# Altium schematic sheet 04 MCU.SchDoc: MCU
size 420 x 297 mm; SheetNumber: 3; SheetTotal: 10
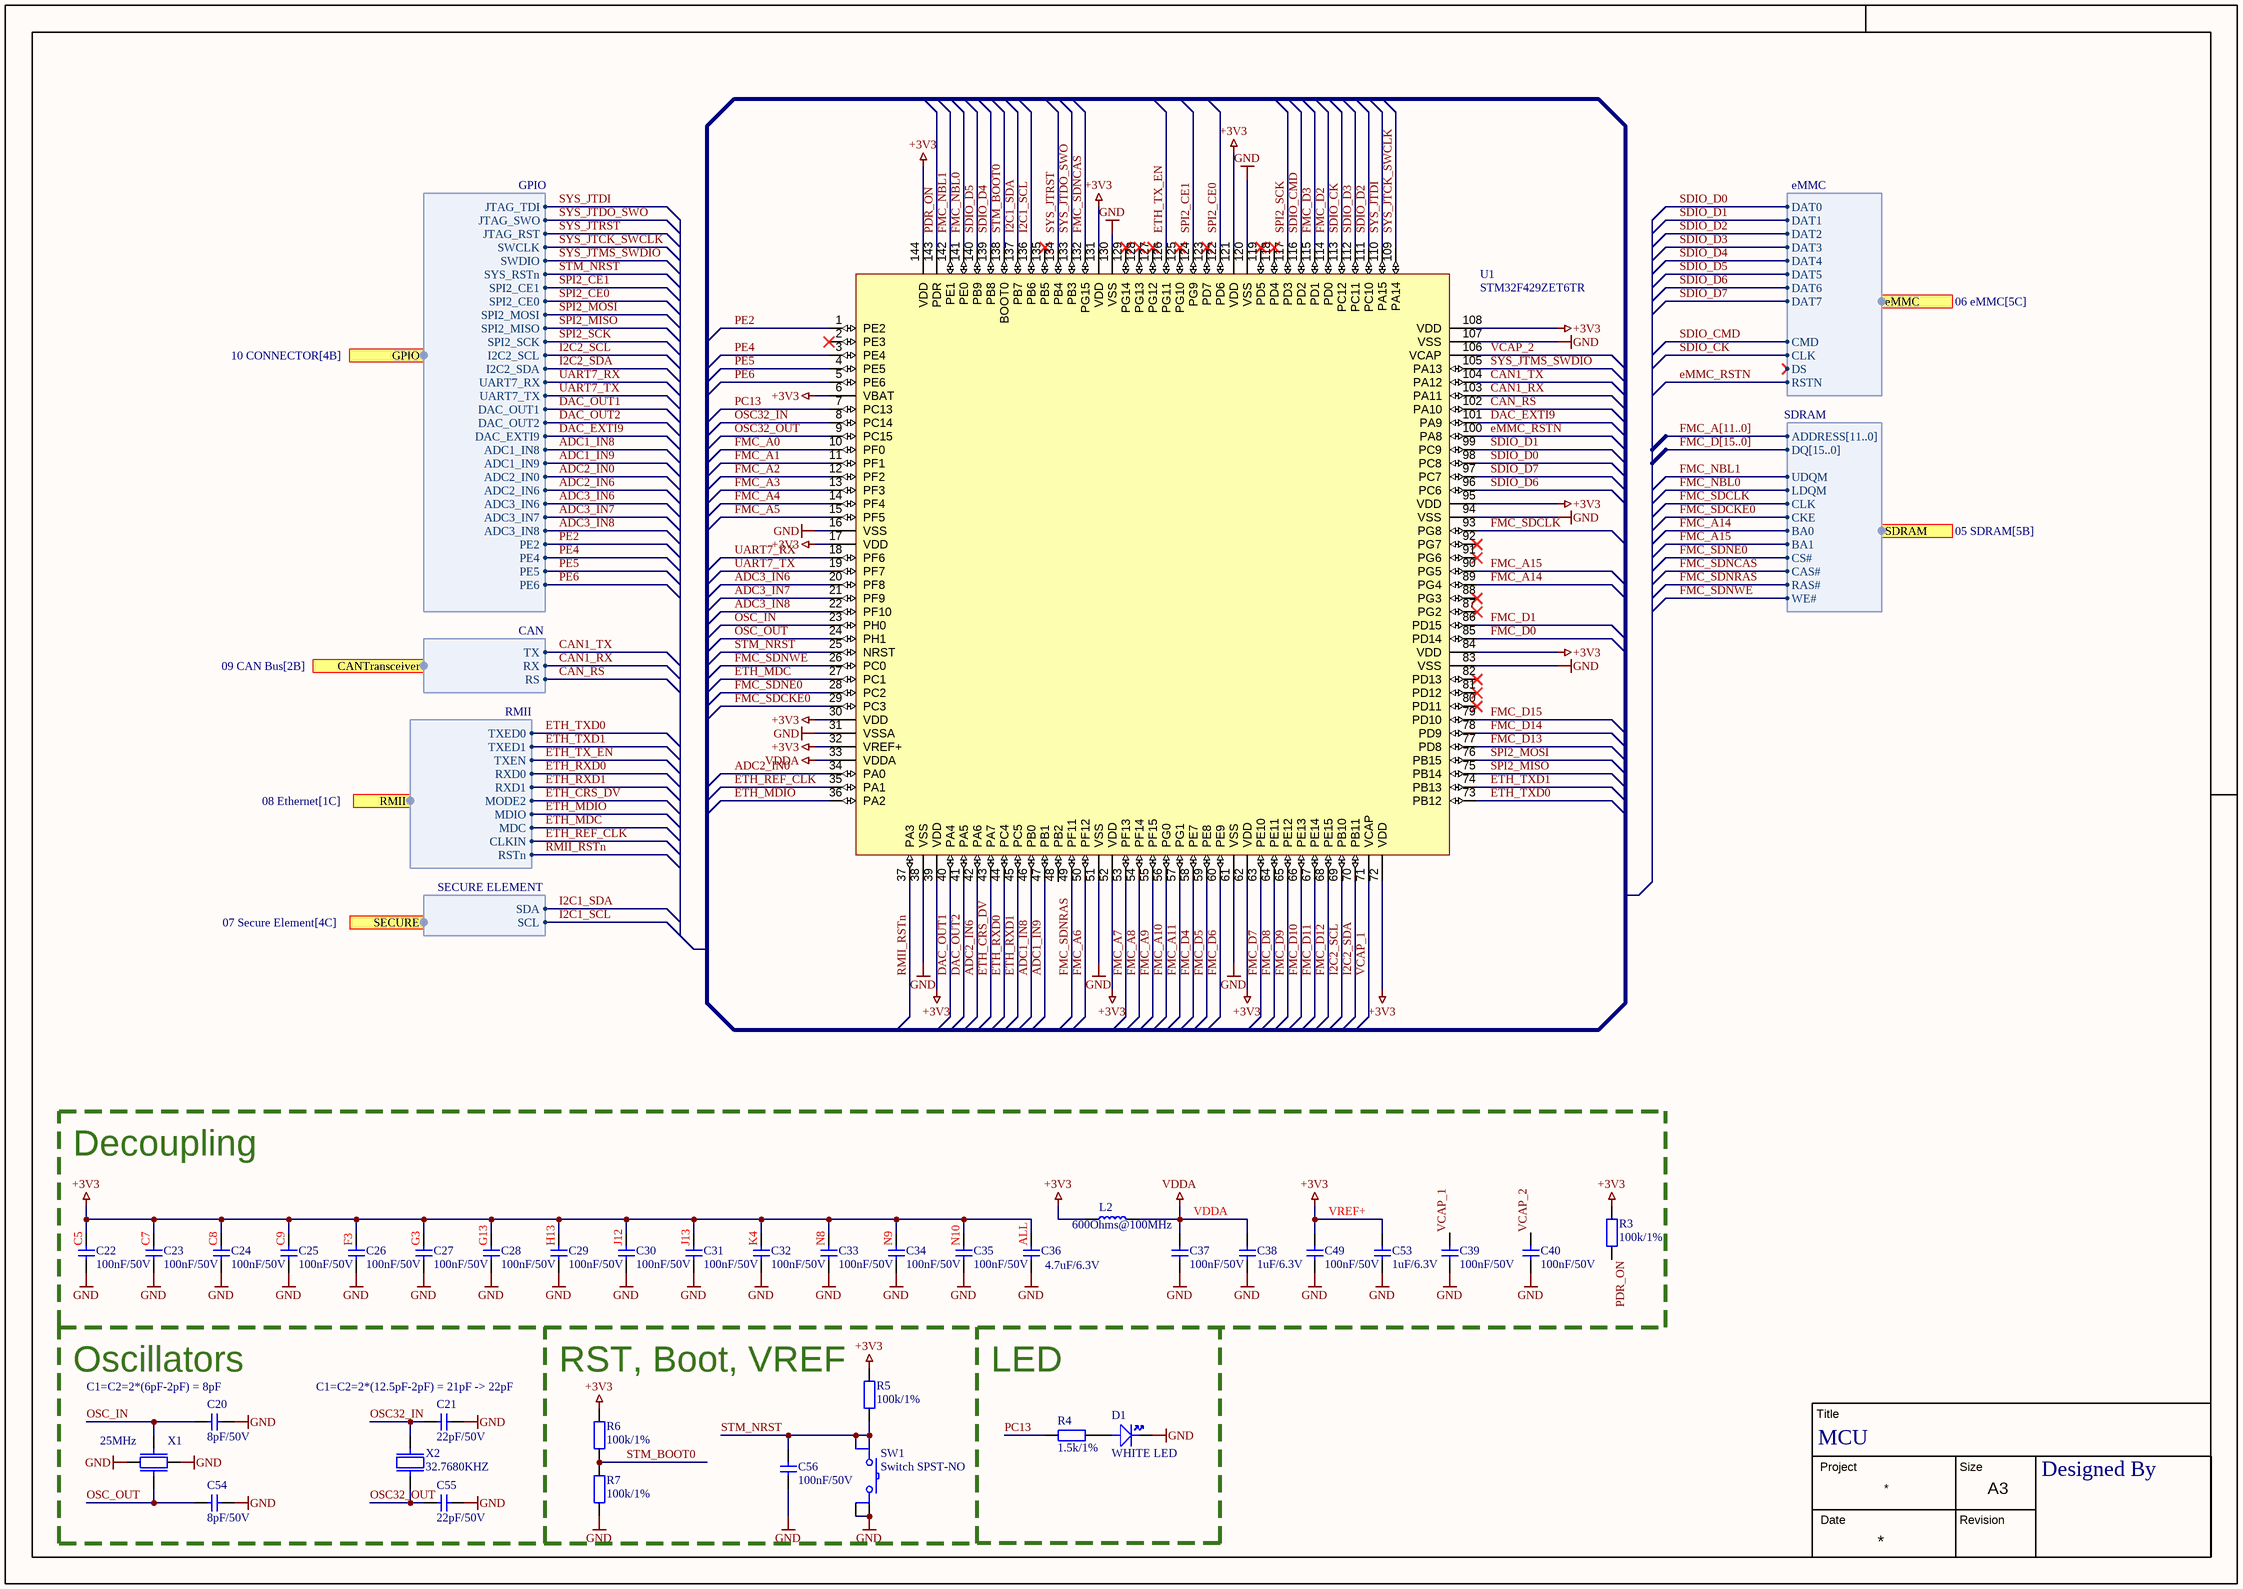
[diagram p0: 04 MCU.SchDoc]

## Parts
C20  8pF/50V  [CAPC1005X06M-0402]
C21  22pF/50V  [CAPC1005X06M-0402]
C22  100nF/50V  [CAPC1005X06M-0402]
C23  100nF/50V  [CAPC1005X06M-0402]
C24  100nF/50V  [CAPC1005X06M-0402]
C25  100nF/50V  [CAPC1005X06M-0402]
C26  100nF/50V  [CAPC1005X06M-0402]
C27  100nF/50V  [CAPC1005X06M-0402]
C28  100nF/50V  [CAPC1005X06M-0402]
C29  100nF/50V  [CAPC1005X06M-0402]
C30  100nF/50V  [CAPC1005X06M-0402]
C31  100nF/50V  [CAPC1005X06M-0402]
C32  100nF/50V  [CAPC1005X06M-0402]
C33  100nF/50V  [CAPC1005X06M-0402]
C34  100nF/50V  [CAPC1005X06M-0402]
C35  100nF/50V  [CAPC1005X06M-0402]
C36  4.7uF/6.3V  [CAPC1005X06M-0402]
C37  100nF/50V  [CAPC1005X06M-0402]
C38  1uF/6.3V  [CAPC1005X06M-0402]
C39  100nF/50V  [CAPC1005X06M-0402]
C40  100nF/50V  [CAPC1005X06M-0402]
C49  100nF/50V  [CAPC1005X06M-0402]
C53  1uF/6.3V  [CAPC1005X06M-0402]
C54  8pF/50V  [CAPC1005X06M-0402]
C55  22pF/50V  [CAPC1005X06M-0402]
C56  100nF/50V  [CAPC1005X06M-0402]
D1  WHITE LED  [LED-0402]
L2  600Ohms@100MHz  [INDC1005X06M-0402]
R3  100k/1%  [RESC1005X04M-0402]
R4  1.5k/1%  [RESC1005X04M-0402]
R5  100k/1%  [RESC1005X04M-0402]
R6  100k/1%  [RESC1005X04M-0402]
R7  100k/1%  [RESC1005X04M-0402]
SW1  Switch SPST-NO  [PTS815 SJM 250 SMTR LFS]
U1  STM32F429ZET6TR  [TSQFP50P2200X2200X160-144N]
X1  25MHz  [4-SMD]
X2  32.7680KHZ  [2-SMD]

## Ports
CANTransceiver (harness CAN, see 09 CAN Bus[2B]), eMMC (harness eMMC, see 06 eMMC[5C]), GPIO (harness GPIO, see 10 CONNECTOR[4B]), RMII (harness RMII, see 08 Ethernet[1C]), SDRAM (harness SDRAM, see 05 SDRAM[5B]), SECURE (harness SECURE ELEMENT, see 07 Secure Element[4C])

## Harnesses
SDRAM: ADDRESS[11..0], DQ[15..0], UDQM, LDQM, CLK, CKE, BA0, BA1, CS#, CAS#, RAS#, WE#
SECURE ELEMENT: SDA, SCL
RMII: TXED0, TXED1, TXEN, RXD0, RXD1, MODE2, MDIO, MDC, CLKIN, RSTn
GPIO: JTAG_TDI, JTAG_SWO, JTAG_RST, SWCLK, SWDIO, SYS_RSTn, SPI2_CE1, SPI2_CE0, SPI2_MOSI, SPI2_MISO, SPI2_SCK, I2C2_SCL, I2C2_SDA, UART7_RX, UART7_TX, DAC_OUT1, DAC_OUT2, DAC_EXTI9, ADC1_IN8, ADC1_IN9, ADC2_IN0, ADC2_IN6, ADC3_IN6, ADC3_IN7, ADC3_IN8, PE2, PE4, PE5, PE6
CAN: TX, RX, RS
eMMC: DAT0, DAT1, DAT2, DAT3, DAT4, DAT5, DAT6, DAT7, CMD, CLK, DS, RSTN

## Nets
+3V3: C22.2 C23.2 C24.2 C25.2 C26.2 C27.2 C28.2 C29.2 C30.2 C31.2 C32.2 C33.2 C34.2 C35.2 C36.2 C49.2 C53.2 L2.1 R3.1 R5.1 R6.1 U1.6(VBAT) U1.17(VDD) U1.30(VDD) U1.32(VREF+) U1.39(VDD) U1.52(VDD) U1.62(VDD) U1.72(VDD) U1.84(VDD) U1.95(VDD) U1.108(VDD) U1.121(VDD) U1.131(VDD) U1.144(VDD)
GND: C20.2 C21.2 C22.1 C23.1 C24.1 C25.1 C26.1 C27.1 C28.1 C29.1 C30.1 C31.1 C32.1 C33.1 C34.1 C35.1 C36.1 C37.1 C38.1 C39.1 C40.1 C49.1 C53.1 C54.2 C55.2 C56.1 D1.1 R7.1 SW1.3 SW1.4 U1.16(VSS) U1.31(VSSA) U1.38(VSS) U1.51(VSS) U1.61(VSS) U1.83(VSS) U1.94(VSS) U1.107(VSS) U1.120(VSS) U1.130(VSS) X1.2 X1.4
VDDA: C37.2 C38.2 L2.2 U1.33(VDDA)
ADC1_IN8: U1.46(PB0) ; port GPIO.ADC1_IN8
ADC1_IN9: U1.47(PB1) ; port GPIO.ADC1_IN9
ADC2_IN0: U1.34(PA0) ; port GPIO.ADC2_IN0
ADC2_IN6: U1.42(PA6) ; port GPIO.ADC2_IN6
ADC3_IN6: U1.20(PF8) ; port GPIO.ADC3_IN6
ADC3_IN7: U1.21(PF9) ; port GPIO.ADC3_IN7
ADC3_IN8: U1.22(PF10) ; port GPIO.ADC3_IN8
CAN1_RX: U1.103(PA11) ; port CANTransceiver.RX
CAN1_TX: U1.104(PA12) ; port CANTransceiver.TX
CAN_RS: U1.102(PA10) ; port CANTransceiver.RS
DAC_EXTI9: U1.101(PA9) ; port GPIO.DAC_EXTI9
DAC_OUT1: U1.40(PA4) ; port GPIO.DAC_OUT1
DAC_OUT2: U1.41(PA5) ; port GPIO.DAC_OUT2
eMMC_RSTN: U1.100(PA8) ; port eMMC.RSTN
ETH_CRS_DV: U1.43(PA7) ; port RMII.MODE2
ETH_MDC: U1.27(PC1) ; port RMII.MDC
ETH_MDIO: U1.36(PA2) ; port RMII.MDIO
ETH_REF_CLK: U1.35(PA1) ; port RMII.CLKIN
ETH_RXD0: U1.44(PC4) ; port RMII.RXD0
ETH_RXD1: U1.45(PC5) ; port RMII.RXD1
ETH_TX_EN: U1.126(PG11) ; port RMII.TXEN
ETH_TXD0: U1.73(PB12) ; port RMII.TXED0
ETH_TXD1: U1.74(PB13) ; port RMII.TXED1
FMC_A0: U1.10(PF0)
FMC_A1: U1.11(PF1)
FMC_A2: U1.12(PF2)
FMC_A3: U1.13(PF3)
FMC_A4: U1.14(PF4)
FMC_A5: U1.15(PF5)
FMC_A6: U1.50(PF12)
FMC_A7: U1.53(PF13)
FMC_A8: U1.54(PF14)
FMC_A9: U1.55(PF15)
FMC_A10: U1.56(PG0)
FMC_A11: U1.57(PG1)
FMC_A14: U1.89(PG4) ; port SDRAM.BA0
FMC_A15: U1.90(PG5) ; port SDRAM.BA1
FMC_D0: U1.85(PD14)
FMC_D1: U1.86(PD15)
FMC_D2: U1.114(PD0)
FMC_D3: U1.115(PD1)
FMC_D4: U1.58(PE7)
FMC_D5: U1.59(PE8)
FMC_D6: U1.60(PE9)
FMC_D7: U1.63(PE10)
FMC_D8: U1.64(PE11)
FMC_D9: U1.65(PE12)
FMC_D10: U1.66(PE13)
FMC_D11: U1.67(PE14)
FMC_D12: U1.68(PE15)
FMC_D13: U1.77(PD8)
FMC_D14: U1.78(PD9)
FMC_D15: U1.79(PD10)
FMC_NBL0: U1.141(PE0) ; port SDRAM.LDQM
FMC_NBL1: U1.142(PE1) ; port SDRAM.UDQM
FMC_SDCKE0: U1.29(PC3) ; port SDRAM.CKE
FMC_SDCLK: U1.93(PG8) ; port SDRAM.CLK
FMC_SDNCAS: U1.132(PG15) ; port SDRAM.CAS#
FMC_SDNE0: U1.28(PC2) ; port SDRAM.CS#
FMC_SDNRAS: U1.49(PF11) ; port SDRAM.RAS#
FMC_SDNWE: U1.26(PC0) ; port SDRAM.WE#
I2C1_SCL: U1.136(PB6) ; port SECURE.SCL
I2C1_SDA: U1.137(PB7) ; port SECURE.SDA
I2C2_SCL: U1.69(PB10) ; port GPIO.I2C2_SCL
I2C2_SDA: U1.70(PB11) ; port GPIO.I2C2_SDA
OSC32_IN: C21.1 U1.8(PC14) X2.2
OSC32_OUT: C55.1 U1.9(PC15) X2.1
OSC_IN: C20.1 U1.23(PH0) X1.3
OSC_OUT: C54.1 U1.24(PH1) X1.1
PC13: R4.1 U1.7(PC13)
PDR_ON: R3.2 U1.143(PDR)
PE2: U1.1(PE2) ; port GPIO.PE2
PE4: U1.3(PE4) ; port GPIO.PE4
PE5: U1.4(PE5) ; port GPIO.PE5
PE6: U1.5(PE6) ; port GPIO.PE6
RMII_RSTn: U1.37(PA3) ; port RMII.RSTn
SDIO_CK: U1.113(PC12) ; port eMMC.CLK
SDIO_CMD: U1.116(PD2) ; port eMMC.CMD
SDIO_D0: U1.98(PC8) ; port eMMC.DAT0
SDIO_D1: U1.99(PC9) ; port eMMC.DAT1
SDIO_D2: U1.111(PC10) ; port eMMC.DAT2
SDIO_D3: U1.112(PC11) ; port eMMC.DAT3
SDIO_D4: U1.139(PB8) ; port eMMC.DAT4
SDIO_D5: U1.140(PB9) ; port eMMC.DAT5
SDIO_D6: U1.96(PC6) ; port eMMC.DAT6
SDIO_D7: U1.97(PC7) ; port eMMC.DAT7
SPI2_CE0: U1.122(PD6) ; port GPIO.SPI2_CE0
SPI2_CE1: U1.124(PG9) ; port GPIO.SPI2_CE1
SPI2_MISO: U1.75(PB14) ; port GPIO.SPI2_MISO
SPI2_MOSI: U1.76(PB15) ; port GPIO.SPI2_MOSI
SPI2_SCK: U1.117(PD3) ; port GPIO.SPI2_SCK
STM_BOOT0: R6.2 R7.2 U1.138(BOOT0)
STM_NRST: C56.2 R5.2 SW1.1 SW1.2 U1.25(NRST) ; port GPIO.SYS_RSTn
SYS_JTCK_SWCLK: U1.109(PA14) ; port GPIO.SWCLK
SYS_JTDI: U1.110(PA15) ; port GPIO.JTAG_TDI
SYS_JTDO_SWO: U1.133(PB3) ; port GPIO.JTAG_SWO
SYS_JTMS_SWDIO: U1.105(PA13) ; port GPIO.SWDIO
SYS_JTRST: U1.134(PB4) ; port GPIO.JTAG_RST
UART7_RX: U1.18(PF6) ; port GPIO.UART7_RX
UART7_TX: U1.19(PF7) ; port GPIO.UART7_TX
VCAP_1: C39.2 U1.71(VCAP)
VCAP_2: C40.2 U1.106(VCAP)
NetD1_2: D1.2 R4.2

Not connected (* = marked no-connect by the designer): U1 2(PE3)* 48(PB2) 80(PD11)* 81(PD12)* 82(PD13)* 87(PG2)* 88(PG3)* 91(PG6)* 92(PG7)* 118(PD4)* 119(PD5)* 123(PD7)* 125(PG10)* 127(PG12)* 128(PG13)* 129(PG14)* 135(PB5)*

## Buses and harness runs
bus FMC_A[11..0]
bus FMC_D[15..0]

## Notes on the sheet
- Decoupling
- (near C22) C5
- (near C23) C7
- (near C24) C8
- (near C25) C9
- (near C26) F3
- (near C27) G3
- (near C28) G13
- (near C29) H13
- (near C30) J12
- (near C31) J13
- (near C32) K4
- (near C33) N8
- (near C34) N9
- (near C35) N10
- (near C36) ALL
- VDDA
- VREF+
- (near C20) Oscillators
- (near C20) C1=C2=2*(6pF-2pF) = 8pF
- (near C21) C1=C2=2*(12.5pF-2pF) = 21pF -> 22pF
- RST, Boot, VREF
- LED
- Title
- Project
- Size
- Date
- Revision
- A3
- Designed By

## Library data of the parts
C20 C54 = GRM1555C1H8R0BA01D: 8 pF ±0.1pF 50V Ceramic Capacitor C0G, NP0 0402 (1005 Metric); ComponentLink1Description: Datasheet; ComponentLink1URL: https://search.murata.co.jp/Ceramy/image/img/A01X/G101/ENG/GRM155R60J475ME47-01.pdf; MPN: GRM1555C1H8R0BA01D
C21 C55 = GRM1555C1H220JA01D: 22 pF ±5% 50V Ceramic Capacitor C0G, NP0 0402 (1005 Metric); ComponentLink1Description: Datasheet; ComponentLink1URL: https://search.murata.co.jp/Ceramy/image/img/A01X/G101/ENG/GRM155R60J475ME47-01.pdf; MPN: GRM1555C1H220JA01D
C22-C35 C37 C39 C40 C49 C56 = GRM155R71H104KE14D: 0.1 µF ±10% 50V Ceramic Capacitor X7R 0402 (1005 Metric); ComponentLink1Description: Datasheet; ComponentLink1URL: https://search.murata.co.jp/Ceramy/image/img/A01X/G101/ENG/GRM155R60J475ME47-01.pdf; MPN: GRM155R71H104KE14D
C36 = GRM155R60J475ME47D: 4.7 µF ±20% 6.3V Ceramic Capacitor X5R 0402 (1005 Metric); ComponentLink1Description: Datasheet; ComponentLink1URL: https://search.murata.co.jp/Ceramy/image/img/A01X/G101/ENG/GRM155R60J475ME47-01.pdf; MPN: GRM155R60J475ME47D
C38 C53 = GRM155R70J105KA12J: 1 µF ±10% 6.3V Ceramic Capacitor X7R 0402 (1005 Metric); ComponentLink1Description: Datasheet; ComponentLink1URL: https://search.murata.co.jp/Ceramy/image/img/A01X/G101/ENG/GRM155R60J475ME47-01.pdf; MPN: GRM155R70J105KA12J
D1 = QBLP595-IW-2897: White LED Indication - Discrete 3.1V 0402 (1005 Metric); ComponentLink1Description: Datasheet; ComponentLink1URL: https://www.qt-brightek.com/datasheet/QBLP595-IW-2897.pdf; MPN: QBLP595-IW-2897
L2 = BLM15AG601SN1D: 600 Ohms @ 100 MHz 1 Ferrite Bead 0402 (1005 Metric) 300mA 520mOhm; ComponentLink1Description: Datasheet; ComponentLink1URL: https://www.murata.com/en-us/products/productdata/8796740059166/ENFA0018.pdf; MPN: BLM15AG601SN1D
R3 R5-R7 = RC0402FR-07100KL: 100 kOhms ±1% 0.063W, 1/16W Chip Resistor 0402 (1005 Metric) Moisture Resistant Thick Film; ComponentLink1Description: Datasheet; ComponentLink1URL: https://www.yageo.com/upload/media/product/productsearch/datasheet/rchip/PYu-RC_Group_51_RoHS_L_12.pdf; MPN: RC0402FR-07100KL
R4 = RC0402FR-071K5L: 1.5 kOhms ±1% 0.063W, 1/16W Chip Resistor 0402 (1005 Metric) Moisture Resistant Thick Film; ComponentLink1Description: Datasheet; ComponentLink1URL: https://www.yageo.com/upload/media/product/productsearch/datasheet/rchip/PYu-RC_Group_51_RoHS_L_12.pdf; MPN: RC0402FR-071K5L
SW1 = PTS815 SJM 250 SMTR LFS: Tactile Switch SPST-NO Top Actuated Surface Mount; ComponentLink1Description: Datasheet; ComponentLink1URL: https://www.ckswitches.com/media/2728/pts815.pdf; MPN: PTS815 SJM 250 SMTR LFS
U1 = STM32F429ZET6TR: ARM® Cortex®-M4 STM32F4 Microcontroller IC 32-Bit Single-Core 180MHz 512KB (512K x 8) FLASH 144-LQFP (20x20); MPN: STM32F429ZET6TR; ComponentLink1Description: New link; ComponentLink1URL: https://www.st.com/content/ccc/resource/technical/document/datasheet/03/b4/b2/36/4c/72/49/29/DM00071990.pdf/files/DM00071990.pdf/jcr:content/translations/en.DM00071990.pdf
X1 = XRCGB25M000F3M00R0: 25 MHz ±30ppm Crystal 6pF 150 Ohms 4-SMD, No Lead; ComponentLink1Description: Datasheet; ComponentLink1URL: https://www.murata.com/~/media/webrenewal/campaign/ads/america/timing/p79e.ashx?la=en-us; MPN: XRCGB25M000F3M00R0
X2 = ECS-.327-12.5-16-TR: 32.768 kHz ±20ppm Crystal 12.5pF 90 kOhms 2-SMD, No Lead; ComponentLink1Description: Datasheet; ComponentLink1URL: https://ecsxtal.com/store/pdf/ECX-16.pdf; MPN: ECS-.327-12.5-16-TR